# Altium schematic sheet Power.SchDoc
size A4
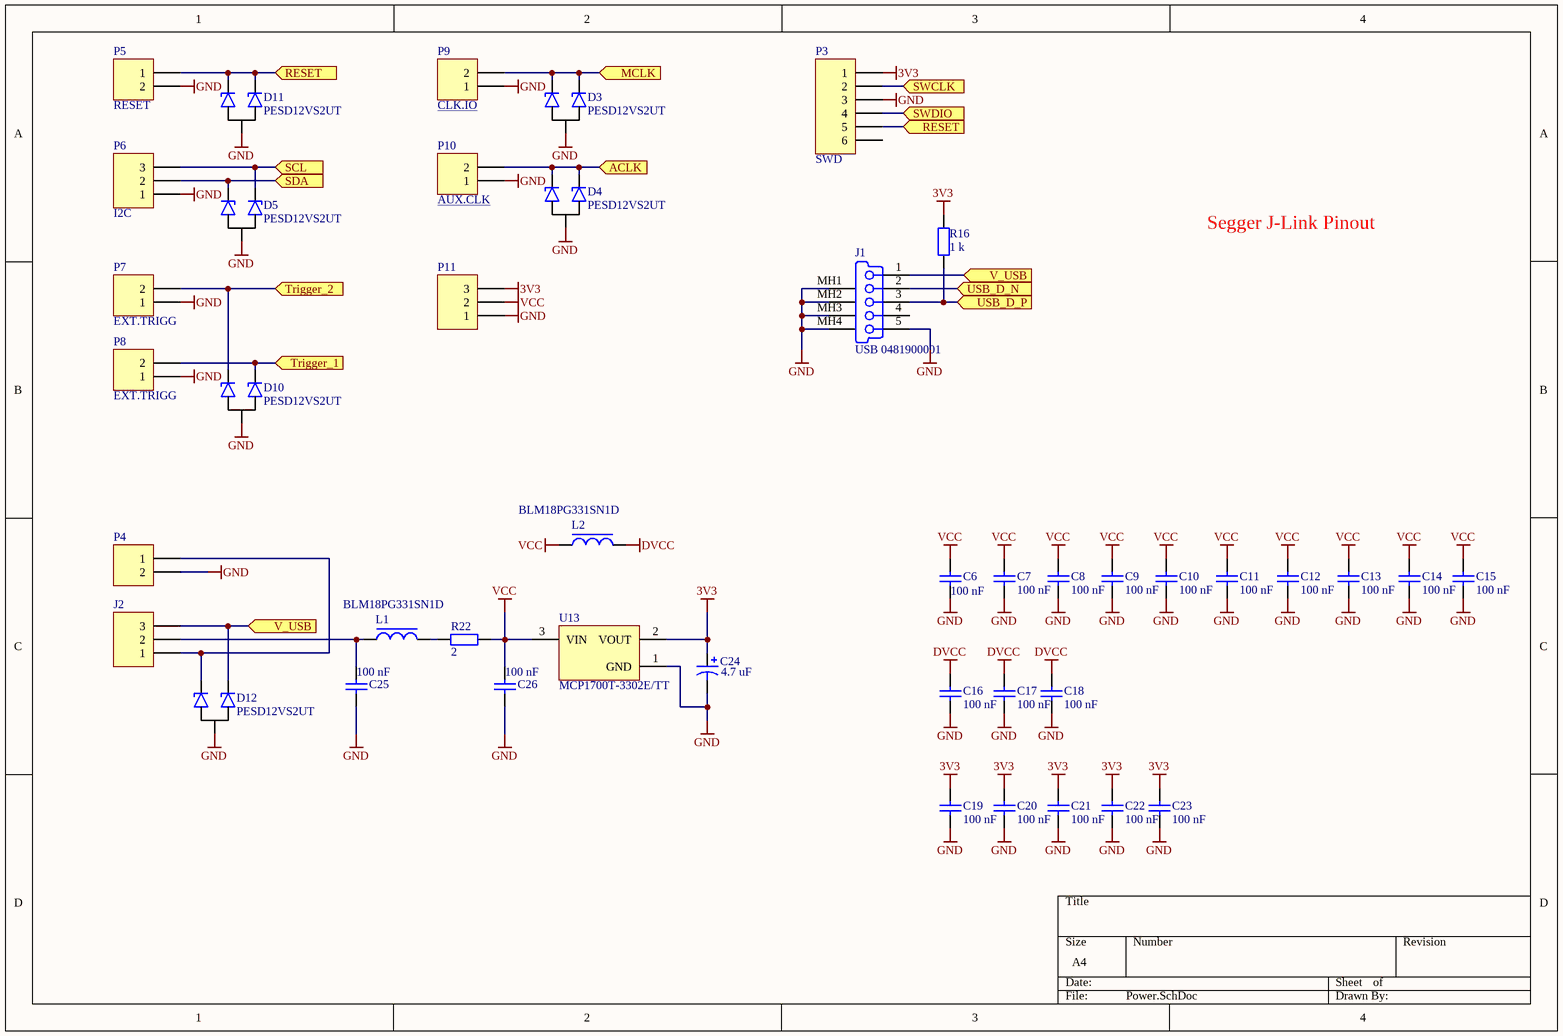
[diagram p0: Power.SchDoc]

## Parts
C6  100 nF  [C1206]
C7  100 nF  [C1206]
C8  100 nF  [C1206]
C9  100 nF  [C1206]
C10  100 nF  [C1206]
C11  100 nF  [C1206]
C12  100 nF  [C1206]
C13  100 nF  [C1206]
C14  100 nF  [C1206]
C15  100 nF  [C1206]
C16  100 nF  [C1206]
C17  100 nF  [C1206]
C18  100 nF  [C1206]
C19  100 nF  [C1206]
C20  100 nF  [C1206]
C21  100 nF  [C1206]
C22  100 nF  [C1206]
C23  100 nF  [C1206]
C24  4.7 uF  [C1206]
C25  100 nF  [C1206]
C26  100 nF  [C1206]
D3  PESD12VS2UT  [SOT-23]
D4  PESD12VS2UT  [SOT-23]
D5  PESD12VS2UT  [SOT-23]
D10  PESD12VS2UT  [SOT-23]
D11  PESD12VS2UT  [SOT-23]
D12  PESD12VS2UT  [SOT-23]
J1  USB 0481900001  [Mini USB-B]
J2  Header 3  [Pin Header 1x3 TH Pitch 2.54mm]  (value not drawn)
L1  BLM18PG331SN1D  [R1206]
L2  BLM18PG331SN1D  [R1206]
P3  SWD  [Pin Header 1x6 TH Pitch 2.54mm]
P4  Header 2  [Pin Header 1x2 TH Pitch 2.54mm]  (value not drawn)
P5  RESET  [Pin Header 1x2 TH Pitch 2.54mm]
P6  I2C  [Pin Header 1x3 TH Pitch 2.54mm]
P7  EXT.TRIGG  [Pin Header 1x2 TH Pitch 2.54mm]
P8  EXT.TRIGG  [Pin Header 1x2 TH Pitch 2.54mm]
P9  CLK.IO  [Pin Header 1x2 TH Pitch 2.54mm]
P10  AUX.CLK  [Pin Header 1x2 TH Pitch 2.54mm]
P11  Header 3  [Pin Header 1x3 TH Pitch 2.54mm]  (value not drawn)
R16  1 k  [R1206]
R22  2  [R1206]
U13  MCP1700T-3302E/TT  [SOT-23_L]

## Ports
ACLK, MCLK, RESET, SCL, SDA, SWCLK, SWDIO, Trigger_1, Trigger_2, USB_D_N, USB_D_P, V_USB

## Nets
3V3: C19.2 C20.2 C21.2 C22.2 C23.2 C24.1 P3.1 P11.3 R16.2 U13.2(VOUT)
DVCC: C16.2 C17.2 C18.2 L2.2
GND: C6.1 C7.1 C8.1 C9.1 C10.1 C11.1 C12.1 C13.1 C14.1 C15.1 C16.1 C17.1 C18.1 C19.1 C20.1 C21.1 C22.1 C23.1 C24.2 C25.2 C26.2 D3.3 D4.3 D5.3 D10.3 D11.3 D12.3 J1.5(GND) J1.MH1(Tab) J1.MH2(Tab) J1.MH3(Tab) J1.MH4(Tab) P3.3 P4.2 P5.2 P6.1 P7.1 P8.1 P9.1 P10.1 P11.1 U13.1(GND)
VCC: C6.2 C7.2 C8.2 C9.2 C10.2 C11.2 C12.2 C13.2 C14.2 C15.2 C26.1 L2.1 P11.2 R22.1 U13.3(VIN)
ACLK: D4.1 D4.2 P10.2 ; port ACLK
MCLK: D3.1 D3.2 P9.2 ; port MCLK
RESET: D11.1 D11.2 P3.5 P5.1 ; port RESET
SCL: D5.2 P6.3 ; port SCL
SDA: D5.1 P6.2 ; port SDA
SWCLK: P3.2 ; port SWCLK
SWDIO: P3.4 ; port SWDIO
Trigger_1: D10.1 P8.2 ; port Trigger_1
Trigger_2: D10.2 P7.2 ; port Trigger_2
USB_D_N: J1.2(D-) ; port USB_D_N
USB_D_P: J1.3(D+) R16.1 ; port USB_D_P
V_USB: D12.1 J1.1(V_BUS_(5V)) J2.3 ; port V_USB
NetC25_1: C25.1 J2.2 L1.1
NetD12_2: D12.2 J2.1 P4.1
NetL1_2: L1.2 R22.2

Not connected (* = marked no-connect by the designer): J1 4(NC); P3 6

## Notes on the sheet
- Segger J-Link Pinout

## Library data of the parts
C6-C23 C25 C26 = Cap Semi: Capacitor (Semiconductor SIM Model); Published: 8-Jun-2000; LatestRevisionDate: 29-May-2009; LatestRevisionNote: IPC-7351 Footprint Added.; PackageReference: C1206; Publisher: Altium Limited; PackageDescription: Chip Capacitor; Value: 100 nF
C24 = Cap Pol3: Polarized Capacitor (Surface Mount); Published: 8-Jun-2000; LatestRevisionDate: 29-May-2009; LatestRevisionNote: IPC-7351 Footprint Added.; PackageReference: C0805; Publisher: Altium Limited; PackageDescription: Chip Capacitor; Value: 4.7 uF
D3-D5 D10-D12 = PESD5V2S2UT: Transil diod
J1 = USB 0481900001: USB On-The-Go (OTG) Mini-B Receptacle, Right Angle, SMT, 0.80mm (.031") Pitch, Solder Tabs with Back Cover, Recessed Type; Manufacture: MOLEX; Assembly: SMD; ComponentSymbol: 48190-0001; ComponentLink1Description: Manufacturer Link; ComponentLink1URL: http://www.molex.com/; ComponentLink2Description: Datasheet; ComponentLink2URL: http://www.molex.com/cmc_upload/0/000/895/958/SD-48190-001RevA.pdf; ComponentType: Connector USB
J2 P6 P11 = Header 3: Header, 3-Pin; LatestRevisionDate: 17-Jul-2002; LatestRevisionNote: Re-released for DXP Platform.; Publisher: Altium Limited
L1 L2 = BLM18PG331SN1D: Ferrit Bead; Manufacture: MURATA; Tolerance1: ± %; Value1: 150mΩ; DafaultFootprint: 0603; Assembly: SMD; Replacement: Rated Current; Value2: 330Ω; Parameter1: DC resistance; Parameter2: Impedance (at 100MHz/20°C); Value3: 1.2A; ComponentLink1URL: http://www.farnell.com/datasheets/5148.pdf?_ga=1.67637201.1104608453.1473079731; ComponentLink2URL: *; ComponentLink1Description: Datasheet; ComponentLink2Description: *; Shop1: *; Shop1ID: *; ComponentType: Ferrite Bead; ComponentSymbol: BLM18PG331SN1D; Tolerance2: ± %; DielectrikType: *
P3 = Header 6: Header, 6-Pin; LatestRevisionDate: 17-Jul-2002; LatestRevisionNote: Re-released for DXP Platform.; Publisher: Altium Limited
P4 P5 P7-P10 = Header 2: Header, 2-Pin; LatestRevisionDate: 17-Jul-2002; LatestRevisionNote: Re-released for DXP Platform.; Publisher: Altium Limited
R16 = Res2: Resistor; Value: 1K; Published: 8-Jun-2000; LatestRevisionDate: 17-Jul-2002; LatestRevisionNote: Re-released for DXP Platform.; PackageReference: AXIAL-0.4; Publisher: Altium Limited; PackageDescription: Axial Device, Thru-Hole; 2 Leads; 0.4 in Pin Spacing
R22 = Res2: Resistor; Value: 10; Published: 8-Jun-2000; LatestRevisionDate: 17-Jul-2002; LatestRevisionNote: Re-released for DXP Platform.; PackageReference: AXIAL-0.4; Publisher: Altium Limited; PackageDescription: Axial Device, Thru-Hole; 2 Leads; 0.4 in Pin Spacing
U13 = MCP1700T-3302E/TT: Low Quiescent Current LDO, 3-Pin SOT-23, Extended Temperature, Tape and Reel; Published: 29-Jan-2009; DatasheetVersion: revB, Feb-2007; PackageVersion: revBB, Aug-2009; PackageReference: SOT-23-TT3; Publisher: Altium Limited; PackageDescription: 3-Lead Plastic Small Outline Transistor (TT) [SOT-23]; Supplier 1: Digi-Key; Supplier Part Number 1: MCP1700T3302ETTTR-ND; Supplier 2: Digi-Key; Supplier Part Number 2: MCP1700T3302ETTCT-ND; Supplier 3: Digi-Key; Supplier Part Number 3: MCP1700T3302ETTDKR-ND; Supplier 4: Farnell; Supplier Part Number 4: 1296592; Code_IPC: SOT23-3; ComponentLink1Description: Datasheet; ComponentLink1URL: http://ww1.microchip.com/downloads/en/DeviceDoc/21826b.pdf; ComponentLink2Description: Packaging Specification; ComponentLink2URL: http://www.microchip.com/stellent/groups/techpub_sg/documents/packagingspec/en012702.pdf; ComponentLink3Description: Microchip.com Home; ComponentLink3URL: http://www.microchip.com/